# Altium schematic sheet Relays and Digital.SchDoc: Relays and Digital
size B; DrawnBy: Jasper Yun; SheetNumber: 3; SheetTotal: 3; Competition: SAC 2021; Subteam: Avionics; University: McGill University; Location: Montreal, Quebec; Project: Avionics Project Name; MRT: McGill Rocket Team
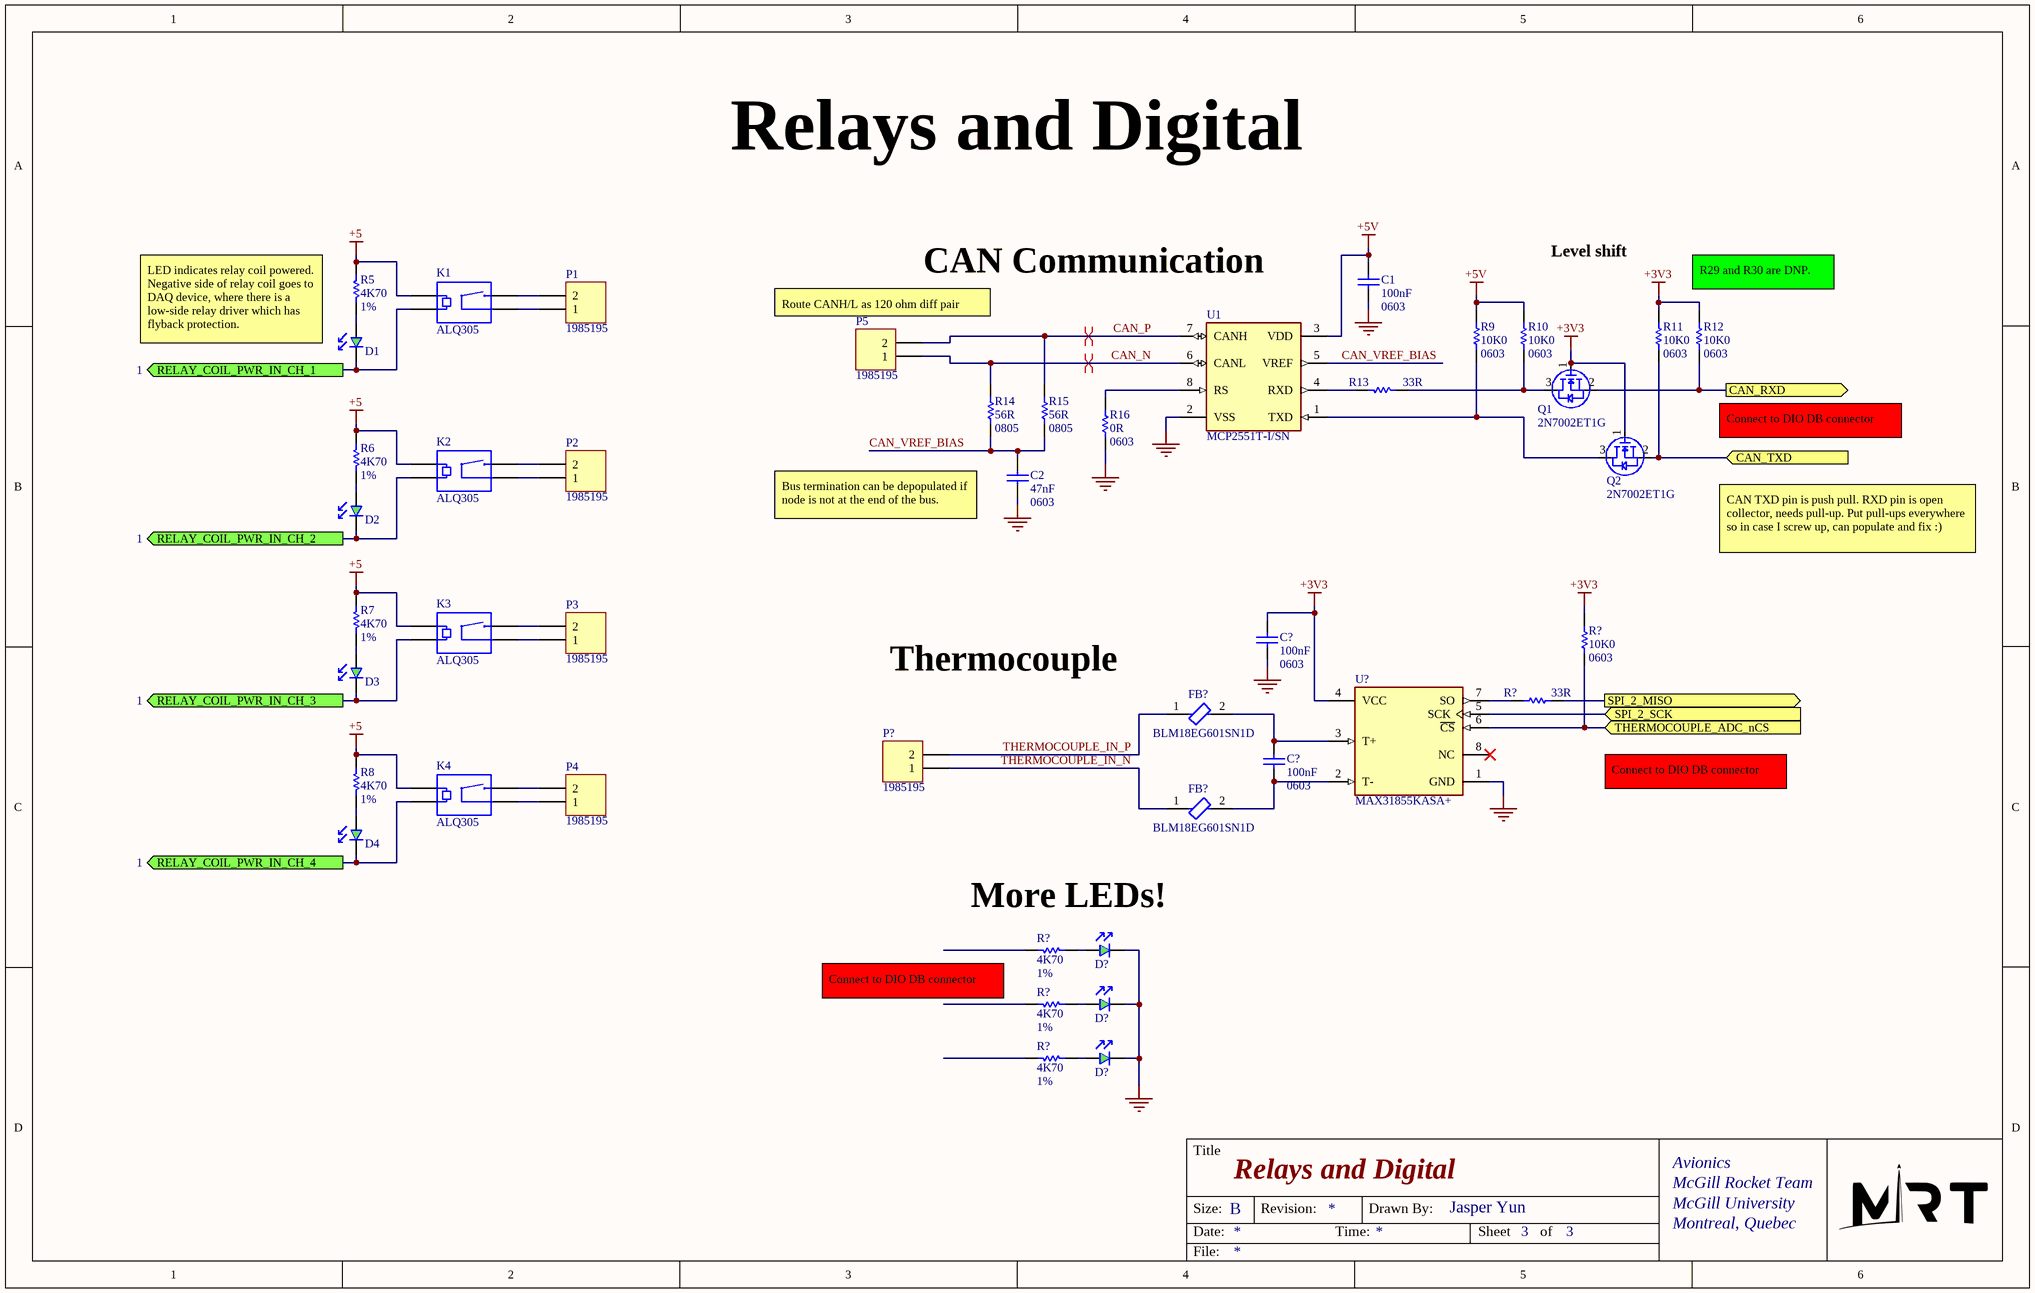
[diagram p0: Relays and Digital.SchDoc]

## Parts
(Parts that share a designator on the sheet are numbered #1, #2 ... from top to bottom, then left to right.)
C1  100nF  value 0603  [0603 CAP SAMSUNG CL10C]
C2  47nF  value 0603  [0603 CAP SAMSUNG CL10C]
C?#1  100nF  value 0603  [0603 CAP SAMSUNG CL10C]
C?#2  100nF  value 0603  [0603 CAP SAMSUNG CL10C]
D1  LED Green  [0603 LED]  (value not drawn)
D2  LED Green  [0603 LED]  (value not drawn)
D3  LED Green  [0603 LED]  (value not drawn)
D4  LED Green  [0603 LED]  (value not drawn)
D?#1  LED Green  [0603 LED]  (value not drawn)
D?#2  LED Green  [0603 LED]  (value not drawn)
D?#3  LED Green  [0603 LED]  (value not drawn)
FB?#1  BLM18EG601SN1D  [FP-BLM18-0_15-t0_8-MFG]
FB?#2  BLM18EG601SN1D  [FP-BLM18-0_15-t0_8-MFG]
K1  ALQ305  [RELAY ALQ305 FORM A]
K2  ALQ305  [RELAY ALQ305 FORM A]
K3  ALQ305  [RELAY ALQ305 FORM A]
K4  ALQ305  [RELAY ALQ305 FORM A]
P1  1985195  [Terminal Block 1985195 2-pos 3.5mm pitch]
P2  1985195  [Terminal Block 1985195 2-pos 3.5mm pitch]
P3  1985195  [Terminal Block 1985195 2-pos 3.5mm pitch]
P4  1985195  [Terminal Block 1985195 2-pos 3.5mm pitch]
P5  1985195  [Terminal Block 1985195 2-pos 3.5mm pitch]
P?  1985195  [Terminal Block 1985195 2-pos 3.5mm pitch]
Q1  2N7002ET1G  [SOT23-3]
Q2  2N7002ET1G  [SOT23-3]
R5  4K70  value 1%  [0603 RES]
R6  4K70  value 1%  [0603 RES]
R7  4K70  value 1%  [0603 RES]
R8  4K70  value 1%  [0603 RES]
R9  10K0  value 0603  [0603 RES]
R10  10K0  value 0603  [0603 RES]
R11  10K0  value 0603  [0603 RES]
R12  10K0  value 0603  [0603 RES]
R13  33R  [0603 RES]
R14  56R  value 0805  [0805 RES]
R15  56R  value 0805  [0805 RES]
R16  0R  value 0603  [0603 RES]
R?#1  10K0  value 0603  [0603 RES]
R?#2  33R  [0603 RES]
R?#3  4K70  value 1%  [0603 RES]
R?#4  4K70  value 1%  [0603 RES]
R?#5  4K70  value 1%  [0603 RES]
U1  MCP2551T-I/SN  [FP-C04-057-SN-IPC_B]
U?  MAX31855KASA+  [FP-S8-4-MFG]

## Ports
CAN_RXD (out), CAN_TXD (in), RELAY_COIL_PWR_IN_CH_1 (out, see 1), RELAY_COIL_PWR_IN_CH_2 (out, see 1), RELAY_COIL_PWR_IN_CH_3 (out, see 1), RELAY_COIL_PWR_IN_CH_4 (out, see 1), SPI_2_MISO (out), SPI_2_SCK (in), THERMOCOUPLE_ADC_nCS (in)

## Nets
+3V3: C?#1.2 Q1.1(Gate) Q2.1(Gate) R11.2 R12.2 R?#1.2 U?.4(VCC)
+5: K1.1 K2.1 K3.1 K4.1 R5.2 R6.2 R7.2 R8.2
+5V: C1.2 R9.2 R10.2 U1.3(VDD)
GND: C1.1 C2.1 C?#1.1 D?#1.2(Cathode) D?#2.2(Cathode) D?#3.2(Cathode) R16.1 U1.2(VSS) U?.1(GND)
CAN_N: P5.1 R14.2 U1.6(CANL)
CAN_P: P5.2 R15.2 U1.7(CANH)
CAN_RXD: Q1.2(Source) R12.1 ; port CAN_RXD
CAN_TXD: Q2.2(Source) R11.1 ; port CAN_TXD
CAN_VREF_BIAS: C2.2 R14.1 R15.1 U1.5(VREF)
RELAY_COIL_PWR_IN_CH_1: D1.2(Cathode) K1.2 ; port RELAY_COIL_PWR_IN_CH_1
RELAY_COIL_PWR_IN_CH_2: D2.2(Cathode) K2.2 ; port RELAY_COIL_PWR_IN_CH_2
RELAY_COIL_PWR_IN_CH_3: D3.2(Cathode) K3.2 ; port RELAY_COIL_PWR_IN_CH_3
RELAY_COIL_PWR_IN_CH_4: D4.2(Cathode) K4.2 ; port RELAY_COIL_PWR_IN_CH_4
SPI_2_MISO: R?#2.2 ; port SPI_2_MISO
SPI_2_SCK: U?.5(SCK) ; port SPI_2_SCK
THERMOCOUPLE_ADC_nCS: R?#1.1 U?.6(~{CS}) ; port THERMOCOUPLE_ADC_nCS
THERMOCOUPLE_IN_N: FB?#2.1 P?.1
THERMOCOUPLE_IN_P: FB?#1.1 P?.2
NetC?#2_1: C?#2.1 FB?#2.2 U?.2(T-)
NetC?#2_2: C?#2.2 FB?#1.2 U?.3(T+)
NetD1_1: D1.1(Anode) R5.1
NetD2_1: D2.1(Anode) R6.1
NetD3_1: D3.1(Anode) R7.1
NetD4_1: D4.1(Anode) R8.1
NetD?#1_1: D?#1.1(Anode) R?#3.1
NetD?#2_1: D?#2.1(Anode) R?#4.1
NetD?#3_1: D?#3.1(Anode) R?#5.1
NetK1_3: K1.3 P1.1
NetK1_4: K1.4 P1.2
NetK2_3: K2.3 P2.1
NetK2_4: K2.4 P2.2
NetK3_3: K3.3 P3.1
NetK3_4: K3.4 P3.2
NetK4_3: K4.3 P4.1
NetK4_4: K4.4 P4.2
NetQ1_3: Q1.3(Drain) R10.1 R13.1
NetQ2_3: Q2.3(Drain) R9.1 U1.1(TXD)
NetR13_2: R13.2 U1.4(RXD)
NetR16_2: R16.2 U1.8(RS)
NetR?#2_1: R?#2.1 U?.7(SO)

Not connected (* = marked no-connect by the designer): R?#3 2; R?#4 2; R?#5 2; U? 8(NC)*

## Layout directives
differential pair: CAN_N, CAN_P

## Notes on the sheet
- CAN Communication
- Level shift
- R29 and R30 are DNP.
- LED indicates relay coil powered. Negative side of relay coil goes to DAQ device, where there is a low-side relay driver which has flyback protection.
- (near P5) Route CANH/L as 120 ohm diff pair
- Connect to DIO DB connector
- Bus termination can be depopulated if node is not at the end of the bus.
- CAN TXD pin is push pull. RXD pin is open collector, needs pull-up. Put pull-ups everywhere so in case I screw up, can populate and fix :)
- Thermocouple
- More LEDs!
- (near R?#4) Connect to DIO DB connector
- Title
- Size:
- Date:
- B
- Revision:
- Time:
- Drawn By:
- Sheet
- of
- File:

## Library data of the parts
C1 C2 C?#1 C?#2 = Cap: Capacitor; Published: 8-Jun-2000; LatestRevisionDate: 17-Jul-2002; LatestRevisionNote: Re-released for DXP Platform.; PackageReference: RAD-0.3; Publisher: Altium Limited; PackageDescription: Radial Cap, Thru-Hole; 2 Leads; 0.3 in Pin Spacing
D1-D4 D?#1-D?#3 = LED Green: Generic Green LED
FB?#1 FB?#2 = CMP-0686-00354-3: Chip Ferrite Bead, 0603, 600Ω @ 100MHz, 0.35Ω, 25%, 500mA; Manufacturer Series: BLM18E; Number of Lines: 1; DC Resistance (DCR): 350mR; Impedance: 600R; Material: Steel; Shielding: Unshielded; Package Quantity: 1; Case/Package: 0603; Length: 1.6mm; Packaging: Tape and Reel; Resistance: 350mR; REACH SVHC: No SVHC; Military Standard: Not; Contact Plating: Tin; Termination: SMD/SMT; Number of Circuits: 1; Width: 0.8mm; Test Frequency: 100MHz; DC Current: 500mA; Case Code (Metric): 1608; Max DC Current: 500mA; Max Operating Temperature: 125°C; Current Rating: 500mA; Series: BLM18E; Tolerance: 25%; Min Operating Temperature: -55°C; Frequency: 100MHz; Lead Free: Lead Free; Terminal Finish: Tin; Number of Pins: 2; Max Current Rating: 500mA; Radiation Hardening: No; Case Code (Imperial): 0603; Number of Functions: 1; Depth: 0.8mm; DC Resistance-Max: 350mR; Height: 0.8mm; Core Material: Ferrite; RoHS Compliant: Yes
K1-K4 = Relay ALQ305: RELAY GEN PURPOSE SPST 10A 5V; Manufacturer: Panasonic; Voltage Rating (AC): 250V; Power Rating: 200mW; Coil Resistance: 125R; Coil Current: 40mA; Operate Time: 20ms; Coil Type: Non-Latching; Relay Type: General Purpose; Supplier 1: Digi-Key; Supplier Part Number 1: 255-3559-ND; Manufacturer Part Number: ALQ305; RoHS: Yes; Category: Power Relays; Stock 1: 83; Pricing 1: 1=1.06000, 10=0.99000, 25=0.88000, 50=0.83600, 100=0.79200, 250=0.70400, 500=0.66000, 1000=0.61600, 5000=0.59400 (USD); Number of Pins: 4; Contact Material: Silver; Weight: 7g; Min Operating Temperature: -40°C; Max Operating Temperature: 85°C; Contact Current Rating: 10A; Package Quantity: 100; Packaging: Carton; Power Consumption: 200mW; Throw Configuration: SPST; Termination: PC Pin; Release Time: 20ms; Coil Power: 200mW; Max Voltage Rating (AC): 250V; Coil Voltage (DC): 5V; Length: 20mm; Width: 10mm; Height: 16mm; Depth: 10mm; REACH SVHC: Unknown; Lead Free: Lead Free; ComponentLink1URL: http://www.mouser.com/ds/2/315/lq-catalog-1075796.pdf?src-supplier=Mouser; ComponentLink1Description: http://www.mouser.com/ds/2/315/lq-catalog-1075796.pdf?src-supplier=Mouser; ComponentLink2URL: http://www.alliedelec.com/m/d/b3e6213128df2023f710f2e9cac83292.pdf?src-supplier=Allied+Electronics; ComponentLink2Description: http://www.alliedelec.com/m/d/b3e6213128df2023f710f2e9cac83292.pdf?src-supplier=Allied+Electronics; ComponentLink3URL: http://www.farnell.com/datasheets/2245159.pdf?src-supplier=Farnell; ComponentLink3Description: http://www.farnell.com/datasheets/2245159.pdf?src-supplier=Farnell; ComponentLink4URL: http://components.arrow.com/part/dataview/0323_06571503?src-supplier=Arrow+Europe; ComponentLink4Description: http://components.arrow.com/part/dataview/0323_06571503?src-supplier=Arrow+Europe; ComponentLink5URL: https://media.digikey.com/pdf/Data%20Sheets/Panasonic%20Electric%20Works%20PDFs/ALQ(LQ)Relays_NewProdIntro.pdf?src-supplier=Digi-Key; ComponentLink5Description: https://media.digikey.com/pdf/Data%20Sheets/Panasonic%20Electric%20Works%20PDFs/ALQ(LQ)Relays_NewProdIntro.pdf?src-supplier=Digi-Key; ComponentLink6URL: http://www.farnell.com/datasheets/1972641.pdf?src-supplier=Element14; ComponentLink6Description: http://www.farnell.com/datasheets/1972641.pdf?src-supplier=Element14; ComponentLink7URL: http://www.farnell.com/datasheets/2245159.pdf?src-supplier=Newark; ComponentLink7Description: http://www.farnell.com/datasheets/2245159.pdf?src-supplier=Newark; ComponentLink8URL: http://pewa.panasonic.com/assets/pcsd/catalog/lq-catalog.pdf?src-supplier=Avnet; ComponentLink8Description: http://pewa.panasonic.com/assets/pcsd/catalog/lq-catalog.pdf?src-supplier=Avnet
P1-P5 P? = Header 2: Header, 2-Pin; LatestRevisionDate: 17-Jul-2002; LatestRevisionNote: Re-released for DXP Platform.; Publisher: Altium Limited
Q1 Q2 = NMOS: Generic N-channel MOSFET
R5-R12 R14-R16 R?#1 R?#3-R?#5 = Res1: Resistor; Published: 8-Jun-2000; LatestRevisionDate: 17-Jul-2002; LatestRevisionNote: Re-released for DXP Platform.; PackageReference: AXIAL-0.3; Publisher: Altium Limited; PackageDescription: Axial Device, Thru-Hole; 2 Leads; 0.3 in Pin Spacing
R13 R?#2 = Res1: RC0603FR-0733RL / 0603 / in stock; Value: 1K; Published: 8-Jun-2000; LatestRevisionDate: 17-Jul-2002; LatestRevisionNote: Re-released for DXP Platform.; PackageReference: AXIAL-0.3; Publisher: Altium Limited; PackageDescription: Axial Device, Thru-Hole; 2 Leads; 0.3 in Pin Spacing
U1 = CMP-0186-00037-3: IC TRANSCEIVER HALF 1/1 8SOIC; Interface: CAN; Nominal Supply Current: 75mA; Number of Receive Buffers: 1; Operating Supply Voltage: 5V; Data Rate: 1Mbps; Max Supply Voltage: 5.5V; Min Supply Voltage: 4.5V; Package Quantity: 3300; Packaging: Tape and Reel; REACH SVHC: No SVHC; Radiation Hardening: No; Case/Package: SOIC; Max Supply Current: 75mA; Lead Free: Lead Free; Number of Transmit Buffers: 1; Length: 4.9mm; Number of Transceivers: 1; Min Operating Temperature: -40°C; Number of Pins: 8; Height: 1.5mm; Max Operating Temperature: 85°C; Number of Receivers: 1; Logic Function: Transceiver; Width: 3.9mm; Mount: Surface Mount; Number of Drivers: 1
U? = CMP-0253-00403-2: IC CONV THERMOCOUPLE-DGTL SOIC; Max Supply Voltage: 3.6V; Operating Supply Current: 900uA; Resolution: 14b; Min Supply Voltage: 3V; Output Type: Digital; Interface: SPI; Max Supply Current: 1.5mA; Operating Supply Voltage: 3.3V; Contact Plating: Tin; Packaging: Rail/Tube; Height: 1.5mm; Radiation Hardening: No; Max Operating Temperature: 125°C; Weight: 0.01787oz; Min Operating Temperature: -40°C; Package Quantity: 100; Width: 4mm; Case/Package: SO; Number of Pins: 8; Lead Free: Lead Free; Length: 5mm